# EasyEDA schematic Schematic_Scorpion-Yellow_v12.0.1.json
TITLE: ZS-Scorpion aka "Желток"; REV: 12.2.1; Date: 2025-04-14; Sheet: 1/1; Drawn By: Romych; Company: https://t.me/zs_scorpion
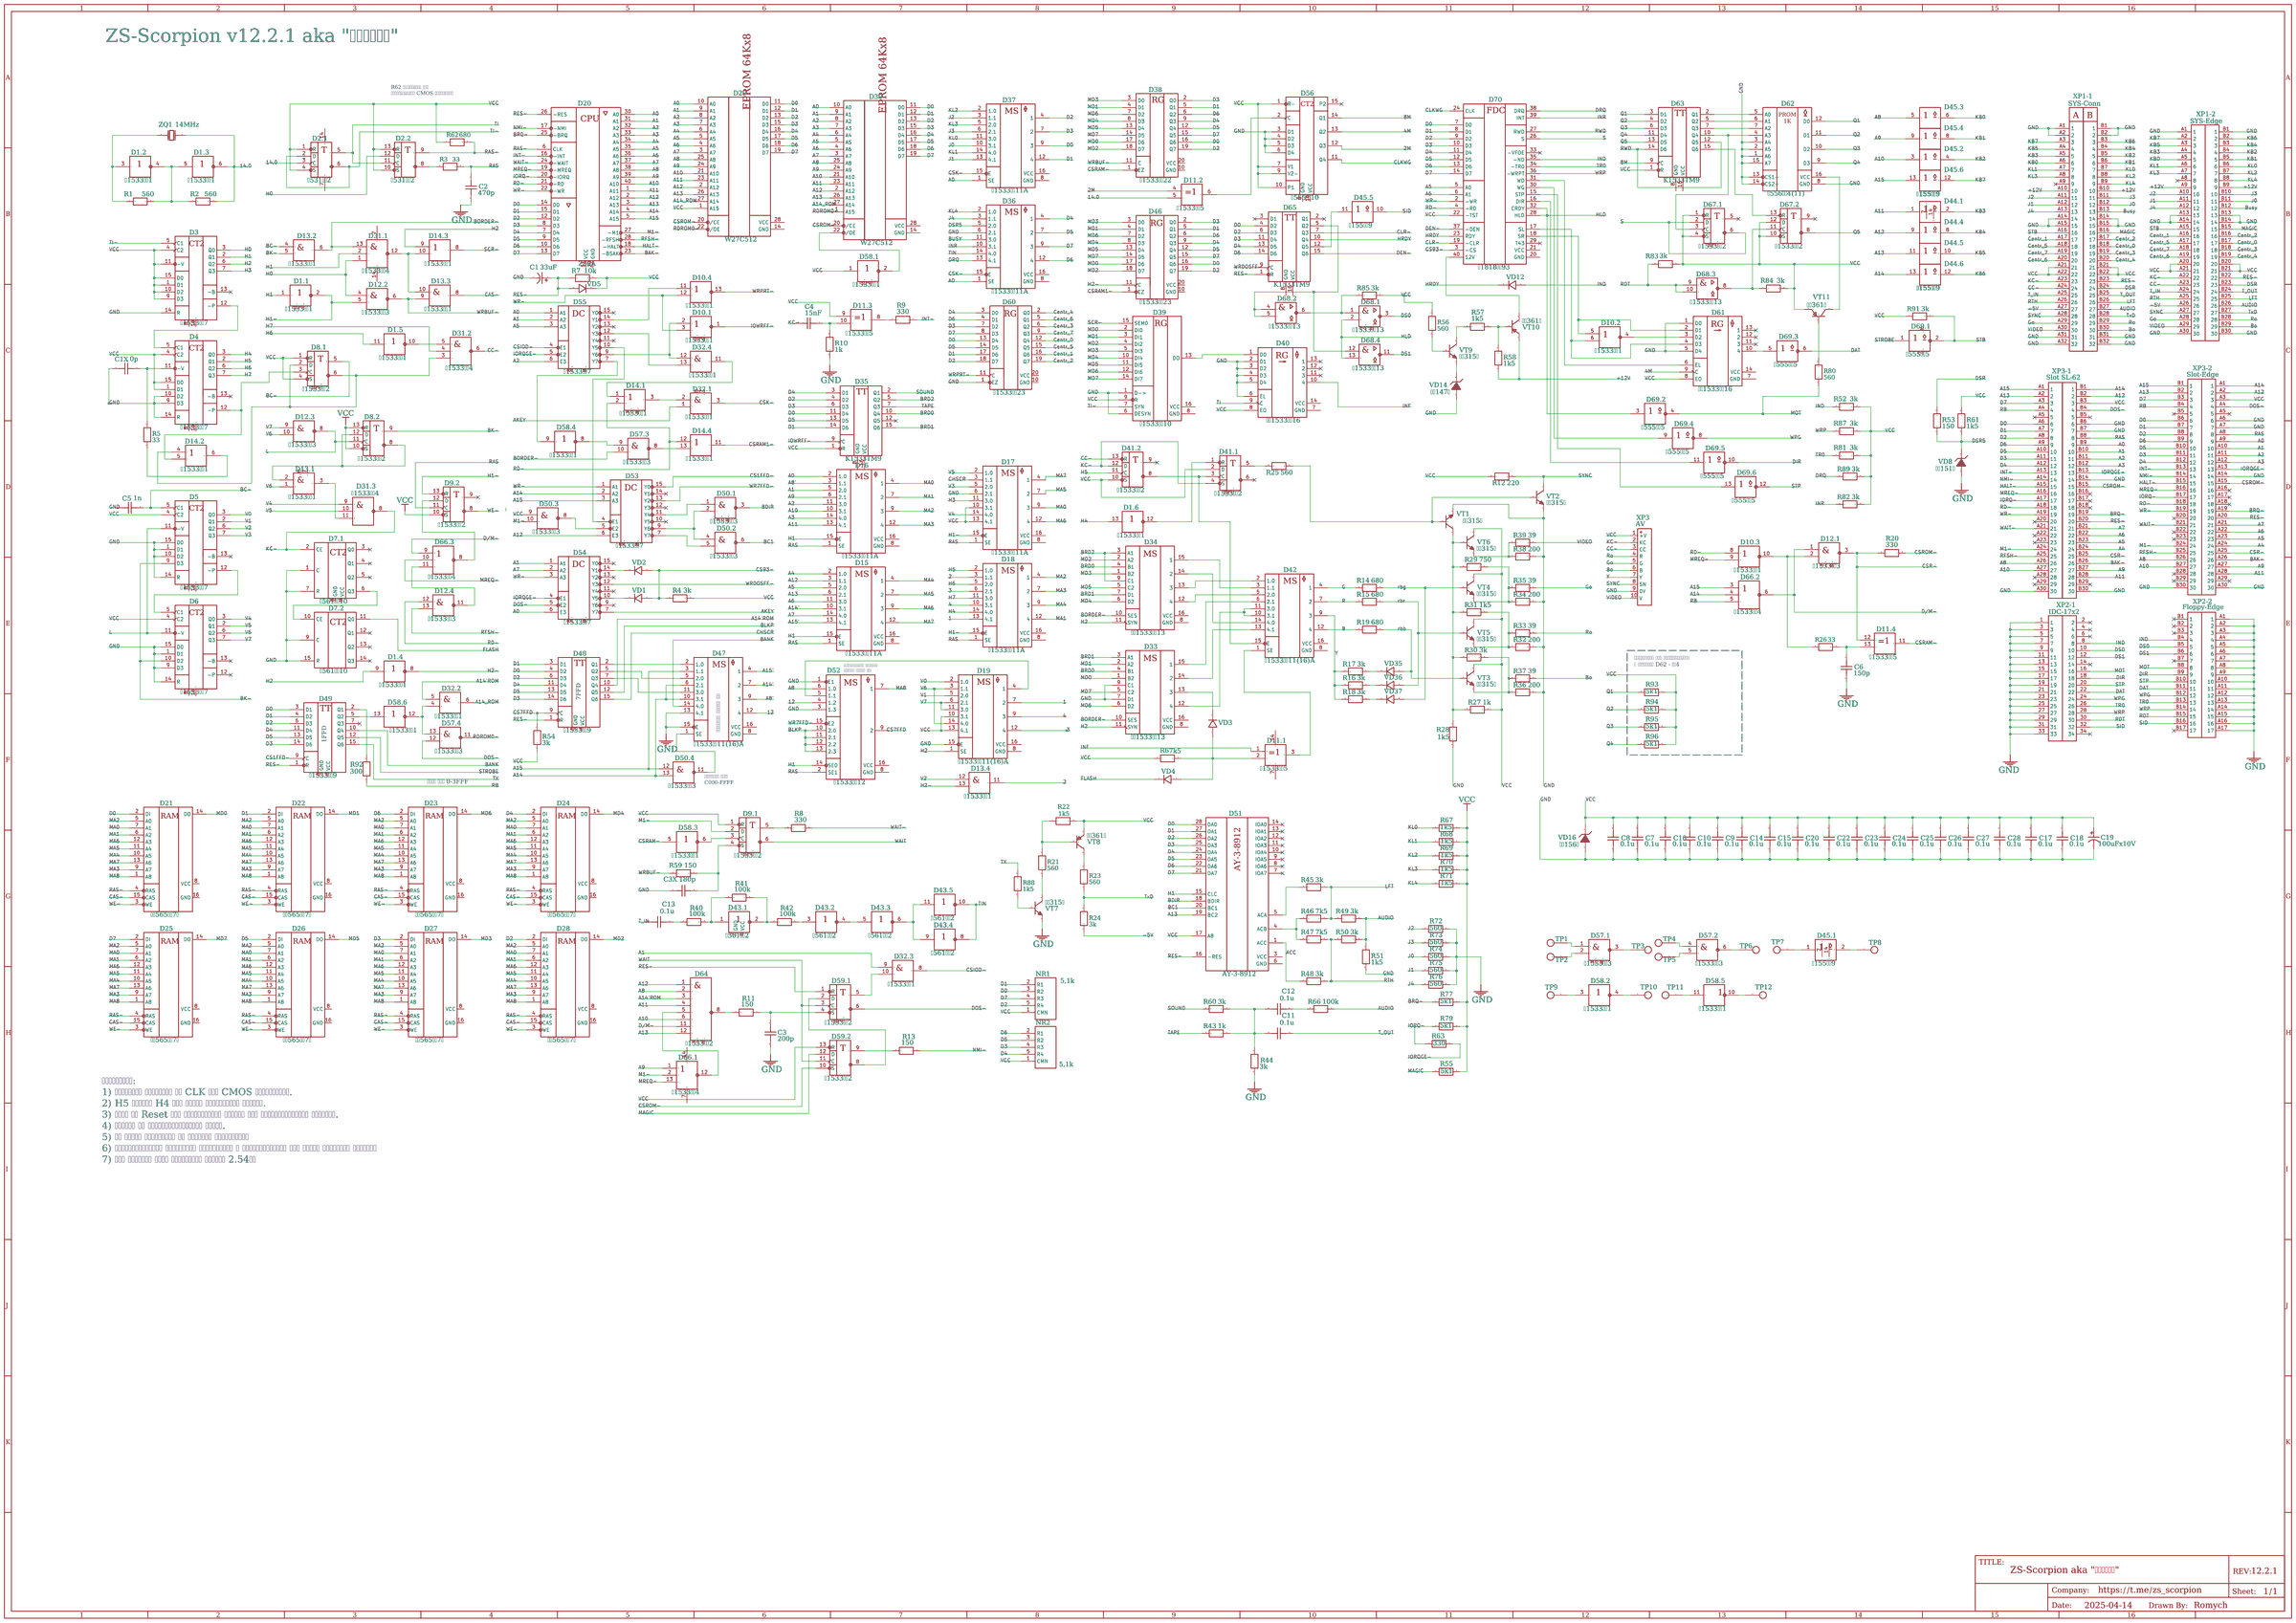
[diagram p0: schematic sheet]

## Parts
C1  33uF  [CAP-TH_BD5.0-P2.50-D1.0-FD]
C1X  0p  [CAP-TH_L3.83]
C2  470p  [CAP-TH_L5.08]
C3  200p  [CAP-TH_L5.08]
C3X  180p  [CAP-TH_L3.83]
C4  15nF  [CAP-TH_L5.08]
C5  1n  [CAP-TH_L3.83]
C6  150p  [CAP-TH_L5.08]
C7  0.1u  [CAP-TH_L5.08]
C8  0.1u  [CAP-TH_L5.08]
C9  0.1u  [CAP-TH_L5.08]
C10  0.1u  [CAP-TH_L5.08]
C11  0.1u  [CAP-TH_L5.08]
C12  0.1u  [CAP-TH_L5.08]
C13  0.1u  [CAP-TH_L5.08]
C14  0.1u  [CAP-TH_L5.08]
C15  0.1u  [CAP-TH_L5.08]
C16  0.1u  [CAP-TH_L5.08]
C17  0.1u  [CAP-TH_L5.08]
C18  0.1u  [CAP-TH_L5.08]
C19  100uFx10V  [CAP-TH_BD6.3-P2.50-D1.0-FD]
C20  0.1u  [CAP-TH_L5.08]
C22  0.1u  [CAP-TH_L5.08]
C23  0.1u  [CAP-TH_L5.08]
C24  0.1u  [CAP-TH_L5.08]
C25  0.1u  [CAP-TH_L5.08]
C26  0.1u  [CAP-TH_L5.08]
C27  0.1u  [CAP-TH_L5.08]
C28  0.1u  [CAP-TH_L5.08]
D1  К1533ЛН1  [DIP-14_STD]  (sections 1,2,3,4,5,6)
D2  К531ТМ2  [DIP-14_STD]  (sections 1,2)
D3  К1533ИЕ7  [DIP-16_STD]
D4  К1533ИЕ7  [DIP-16_STD]
D5  К1533ИЕ7  [DIP-16_STD]
D6  К1533ИЕ7  [DIP-16_STD]
D7  К561ИЕ10  [DIP-16_STD]  (sections 1,2)
D8  К1533ТМ2  [DIP-14_STD]  (sections 1,2)
D9  К1533ТМ2  [DIP-14_STD]  (sections 1,2)
D10  К1533ЛЕ1  [DIP-14_STD]  (sections 1,2,3,4)
D11  К1533ЛП5  [DIP-14_STD]  (sections 1,2,3,4)
D12  К1533ЛА3  [DIP-14_STD]  (sections 1,2,3,4)
D13  К1533ЛИ1  [DIP-14_STD]  (sections 1,2,3,4)
D14  К1533ЛЛ1  [DIP-14_STD]  (sections 1,2,3,4)
D15  К1533КП11A  [DIP-16_STD]
D16  К1533КП11A  [DIP-16_STD]
D17  К1533КП11A  [DIP-16_STD]
D18  К1533КП11A  [DIP-16_STD]
D19  К1533КП11(16)A  [DIP-16_STD]
D20  Z80A  [DIP-40_STD]
D21  КР565РУ7Г  [DIP-16_STD]
D22  КР565РУ7Г  [DIP-16_STD]
D23  КР565РУ7Г  [DIP-16_STD]
D24  КР565РУ7Г  [DIP-16_STD]
D25  КР565РУ7Г  [DIP-16_STD]
D26  КР565РУ7Г  [DIP-16_STD]
D27  КР565РУ7Г  [DIP-16_STD]
D28  КР565РУ7Г  [DIP-16_STD]
D29  W27C512  [DIP-28_L35.6-W17.8-P2.54-LS15.2-BL]
D30  W27C512  [DIP-28_L35.6-W17.8-P2.54-LS15.2-BL]
D31  К1533ЛА4  [DIP-14_STD]  (sections 1,2,3)
D32  К1533ЛИ1  [DIP-14_STD]  (sections 1,2,3,4)
D33  КР1533КП13  [DIP-16_STD]
D34  КР1533КП13  [DIP-16_STD]
D35  K1533TM9  [DIP-16_STD]
D36  К1533КП11A  [DIP-16_STD]
D37  К1533КП11A  [DIP-16_STD]
D38  К1533ИР22  [DIP-20_STD]
D39  К1533ИР10  [DIP-16_STD]
D40  КР1533ИР16  [DIP-14_STD]
D41  К1533ТМ2  [DIP-14_STD]  (sections 1,2)
D42  К1533КП11(16)A  [DIP-16_STD]
D43  К561ЛН2  [DIP-14_STD]  (sections 1,2,3,4,5)
D44  К155ЛП9  [DIP-14_STD]  (sections 1,4,5,6)
D45  К155ЛП9  [DIP-14_STD]  (sections 1,2,3,4,5,6)
D46  К1533ИР23  [DIP-20_STD]
D47  К1533КП11(16)A  [DIP-16_STD]
D48  К1533ТМ9  [DIP-16_STD]
D49  К1533ТМ9  [DIP-16_STD]
D50  К1533ЛА3  [DIP-14_STD]  (sections 1,2,3,4)
D51  AY-3-8912  [DIP-28_STD]
D52  К1533КП12  [DIP-16_STD]
D53  К1533ИД7  [DIP-16_STD]
D54  К1533ИД7  [DIP-16_STD]
D55  К1533ИД7  [DIP-16_STD]
D56  К555ИЕ10  [DIP-16_STD]
D57  К1533ЛА3  [DIP-14_STD]  (sections 1,2,3,4)
D58  К1533ЛН1  [DIP-14_STD]  (sections 1,2,3,4,5,6)
D59  К1533ТМ2  [DIP-14_STD]  (sections 1,2)
D60  К1533ИР23  [DIP-20_STD]
D61  КР1533ИР16  [DIP-14_STD]
D62  К556РТ4(11)  [DIP-16_STD]
D63  K1533TM9  [DIP-16_STD]
D64  К1533ЛА2  [DIP-14_STD]
D65  K1533TM9  [DIP-16_STD]
D66  К1533ЛЕ4  [DIP-14_STD]  (sections 1,2,3)
D67  К1533ТМ2  [DIP-14_STD]  (sections 1,2)
D68  К1533ЛА13  [DIP-14_STD]  (sections 1,2,3,4)
D69  К555ЛН5  [DIP-14_STD]  (sections 1,2,3,4,5,6)
D70  К1818ВГ93  [DIP-40_STD]
NR1  5,1k  [HDR-TH_5P-P2.54]
NR2  5,1k  [HDR-TH_5P-P2.54]
R1  560  [R_0.125_7.62]
R2  560  [R_0.125_7.62]
R3  33  [R_0.125_7.62]
R4  3k  [R_0.125_7.62]
R5  33  [R_0.125_L6.35]
R6  7k5  [R_0.125_7.62]
R7  10k  [R_0.125_7.62]
R8  330  [R_0.125_7.62]
R9  330  [R_0.125_7.62]
R10  1k  [R_0.125_7.62]
R11  150  [R_0.125_7.62]
R12  220  [R_0.125_7.62]
R13  150  [R_0.125_7.62]
R14  680  [R_0.125_7.62]
R15  680  [R_0.125_7.62]
R16  3k  [R_0.125_7.62]
R17  3k  [R_0.125_7.62]
R18  3k  [R_0.125_7.62]
R19  680  [R_0.125_7.62]
R20  330  [R_0.125_7.62]
R21  560  [R_0.125_7.62]
R22  1k5  [R_0.125_7.62]
R23  560  [R_0.125_7.62]
R24  3k  [R_0.125_7.62]
R25  560  [R_0.125_7.62]
R26  33  [R_0.125_7.62]
R27  1k  [R_0.125_7.62]
R28  1k5  [R_0.125_7.62]
R29  750  [R_0.125_7.62]
R30  3k  [R_0.125_7.62]
R31  1k5  [R_0.125_7.62]
R32  200  [R_0.125_7.62]
R33  39  [R_0.125_7.62]
R34  200  [R_0.125_7.62]
R35  39  [R_0.125_7.62]
R36  200  [R_0.125_7.62]
R37  39  [R_0.125_7.62]
R38  200  [R_0.125_7.62]
R39  39  [R_0.125_7.62]
R40  100k  [R_0.125_7.62]
R41  100k  [R_0.125_7.62]
R42  100k  [R_0.125_7.62]
R43  1k  [R_0.125_7.62]
R44  3k  [R_0.125_7.62]
R45  3k  [R_0.125_7.62]
R46  7k5  [R_0.125_7.62]
R47  7k5  [R_0.125_7.62]
R48  3k  [R_0.125_7.62]
R49  3k  [R_0.125_7.62]
R50  3k  [R_0.125_7.62]
R51  1k5  [R_0.125_7.62]
R52  3k  [R_0.125_7.62]
R53  150  [R_0.125_7.62]
R54  3k  [R_0.125_7.62]
R55  5k1  [R_0.125_7.62]
R56  560  [R_0.125_7.62]
R57  1k5  [R_0.125_7.62]
R58  1k5  [R_0.125_7.62]
R59  150  [R_0.125_7.62]
R60  3k  [R_0.125_7.62]
R61  1k5  [R_0.125_7.62]
R62  680  [R_0.125_7.62]
R63  330  [R_0.125_7.62]
R66  100k  [R_0.125_7.62]
R67  1k5  [R_0.125_7.62]
R68  1k5  [R_0.125_7.62]
R69  1k5  [R_0.125_7.62]
R70  1k5  [R_0.125_7.62]
R71  1k5  [R_0.125_7.62]
R72  560  [R_0.125_7.62]
R73  560  [R_0.125_7.62]
R74  560  [R_0.125_7.62]
R75  560  [R_0.125_7.62]
R76  560  [R_0.125_7.62]
R77  5k1  [R_0.125_7.62]
R79  5k1  [R_0.125_7.62]
R80  560  [R_0.125_7.62]
R81  3k  [R_0.125_7.62]
R82  3k  [R_0.125_7.62]
R83  3k  [R_0.125_7.62]
R84  3k  [R_0.125_7.62]
R85  3k  [R_0.125_7.62]
R87  3k  [R_0.125_7.62]
R88  1k5  [R_0.125_7.62]
R89  3k  [R_0.125_7.62]
R91  3k  [R_0.125_7.62]
R92  300  [R_0.125_7.62]
R93  5k1  [R_0.125_7.62]
R94  5k1  [R_0.125_7.62]
R95  5k1  [R_0.125_7.62]
R96  5k1  [R_0.125_7.62]
TP1  SMD-TEST-1-RND  [SMD-TEST-1-SMALL]
TP2  SMD-TEST-1-RND  [SMD-TEST-1-SMALL]
TP3  SMD-TEST-1-RND  [SMD-TEST-1-SMALL]
TP4  SMD-TEST-1-RND  [SMD-TEST-1-SMALL]
TP5  SMD-TEST-1-RND  [SMD-TEST-1-SMALL]
TP6  SMD-TEST-1-RND  [SMD-TEST-1-SMALL]
TP7  SMD-TEST-1-RND  [SMD-TEST-1-SMALL]
TP8  SMD-TEST-1-RND  [SMD-TEST-1-SMALL]
TP9  SMD-TEST-1-RND  [SMD-TEST-1-SMALL]
TP10  SMD-TEST-1-RND  [SMD-TEST-1-SMALL]
TP11  SMD-TEST-1-RND  [SMD-TEST-1-SMALL]
TP12  SMD-TEST-1-RND  [SMD-TEST-1-SMALL]
VD1  1N4148  [D_TH_7.62]
VD2  1N4148  [D_TH_7.62]
VD3  1N4148  [D_TH_7.62]
VD4  1N4148  [D_TH_7.62]
VD5  1N4148  [D_TH_7.62]
VD8  КС151А  [D_TH_7.62]
VD12  1N4148  [D_TH_7.62]
VD14  КС147А  [D_TH_7.62]
VD16  КС156А  [D_TH_7.62]
VD35  1N4148  [D_TH_7.62]
VD36  1N4148  [D_TH_7.62]
VD37  1N4148  [D_TH_7.62]
VT1  КТ315Б  [KT315_STD]
VT2  КТ315Б  [KT315_STD]
VT3  КТ315Б  [KT315_STD]
VT4  КТ315Б  [KT315_STD]
VT5  КТ315Б  [KT315_STD]
VT6  КТ315Б  [KT315_STD]
VT7  КТ315Б  [KT315_STD]
VT8  КТ361Б  [KT315_STD]
VT9  КТ315Б  [KT315_STD]
VT10  КТ361Б  [KT315_STD]
VT11  КТ361Б  [KT315_STD]
XP1-1  SYS-Conn  [CONN_TH_DIN41612_64P_2X32_ANG_INV]
XP1-2  SYS-Edge  [PCB_EDGE_CONNECTOR_30X2]
XP2-1  IDC-17x2  [IDC-TH-34P-17X2_2.54]
XP2-2  Floppy-Edge  [PCB_EDGE_CONNECTOR_17X2]
XP3  AV  [HDR-TH_10P-P2.54-V-M]
XP3-1  Slot SL-62  [SL62_P2.54_R2]
XP3-2  Slot-Edge  [PCB_EDGE_CONNECTOR_30X2]
ZQ1  14MHz  [OSC-49_STD_H]

## Library data of the parts
C1 C19 = ECLJ0612220M101P00: Supplier: LCSC; Supplier Part: C156809; Manufacturer: Guangdong TOPAZ Elec Tech; Contributor: LCSC
C1X C3X C5 = CK45-R3AD152K-VRY: Supplier: LCSC; Supplier Part: C340608; Manufacturer: TDK; Contributor: LCSC; JLCPCB Part Class: Extended Part
C2-C4 C6-C18 C20 C22-C28 = CK45-R3AD152K-VRY: Supplier: LCSC; Supplier Part: C340608; Manufacturer: TDK; Contributor: LCSC
D1 = К1533ЛН1: Supplier: chipdip; Contributor: Roman Boykov; subpart_no: 8
D2 = К531ТМ2: Supplier: chipdip; Contributor: Roman Boykov; subpart_no: 1
D3-D6 = К1533ИЕ7: Contributor: romychs_4693
D7 = К561ИЕ10: Supplier: chipdip; Contributor: romychs_4693; subpart_no: 1
D8 D41 D59 D67 = К1533ТМ2: Supplier: chipdip; Contributor: romychs_4693; subpart_no: 3
D9 = К1533ТМ2: Supplier: chipdip; Contributor: romychs_4693; subpart_no: 4
D10 = К1533ЛЕ1: Supplier: chipdip; Contributor: Roman Boykov; subpart_no: 1
D11 = К1533ЛП5: Supplier: chipdip; Contributor: Roman Boykov; subpart_no: 1
D12 D50 D57 = К1533ЛА3: Supplier: chipdip; Contributor: Roman Boykov; subpart_no: 1
D13 D32 = К1533ЛИ1: Supplier: chipdip; Contributor: Roman Boykov; subpart_no: 1
D14 = К1533ЛЛ1: Supplier: chipdip; Contributor: Roman Boykov; subpart_no: 1
D15-D19 D36 D37 D42 D47 = К1533КП11A: Supplier: chipdip; Contributor: Roman Boykov
D20 = Z80B: Manufacturer: Zilog; Contributor: romychs_4693
D21-D28 = КР565РУ7Г: Supplier: chipdip; Contributor: Roman Boykov
D29 D30 = W27C512-45: Manufacturer: Winbond; Supplier: chipdip; Contributor: Roman Boykov
D31 = К1533ЛА4: Supplier: chipdip; Contributor: Roman Boykov; subpart_no: 1
D33 D34 = КР1533КП13: Supplier: chipdip; Contributor: romychs_4693
D35 D63 D65 = K1533TM9: Supplier: chipdip; Contributor: Roman Boykov
D38 = К1533ИР22: Supplier: chipdip; link: TTL; Регистр; ИР22; Contributor: Roman Boykov
D39 = К1533ИР10: Supplier: chipdip; link: TTL; Регистр; ИР23; Contributor: Roman Boykov
D40 D61 = КР1533ИР16: Supplier: chipdip; Contributor: romychs_4693
D43 = К561ЛН2: Supplier: chipdip; Contributor: romychs_4693; subpart_no: 1
D44 = К155ЛП9: Supplier: chipdip; Contributor: Roman Boykov; subpart_no: 2
D45 = К155ЛП9: Supplier: chipdip; Contributor: Roman Boykov; subpart_no: 5
D46 D60 = К1533ИР23: Supplier: chipdip; link: TTL; Регистр; ИР23; Contributor: romychs_4693
D48 D49 = К1533ТМ9: Supplier: chipdip; Contributor: Roman Boykov
D51 = AY-3-8912: Supplier: chipdip; Contributor: romychs_4693
D52 = К1533КП12: Supplier: chipdip; Contributor: romychs_4693
D53-D55 = К1533ИД7: Supplier: chipdip; Contributor: romychs_4693; subpart_no: 4
D56 = К555ИЕ10: Contributor: romychs_4693
D58 = К1533ЛН1: Supplier: chipdip; Contributor: Roman Boykov; subpart_no: 7
D62 = К556РТ4: Contributor: romychs_4693
D64 = К1533ЛА2: Supplier: chipdip; Contributor: Roman Boykov
D66 = К1533ЛЕ4: Supplier: chipdip; Contributor: Roman Boykov; subpart_no: 1
D68 = К1533ЛА13: Supplier: chipdip; Contributor: Roman Boykov; subpart_no: 1
D69 = К555ЛН5: Supplier: chipdip; Contributor: Roman Boykov; subpart_no: 7
D70 = К1818ВГ93: link: ВГ93; FDD; Contributor: Roman Boykov
NR1 NR2 = НР-4: Supplier: chipdip; Contributor: Roman Boykov
R1-R4 R6-R63 R66-R77 R79-R85 R87-R89 R91-R96 = RN 1/8W 470R F T/B A1: Supplier: LCSC; Supplier Part: C433478; Manufacturer: TyoHM; Contributor: LCSC
R5 = RN 1/8W 470R F T/B A1: Supplier: LCSC; Supplier Part: C433478; Manufacturer: Tyohm(幸亚电阻); Contributor: LCSC; Resistance (Ohms): 470; JLCPCB Part Class: Extended Part
TP1-TP12 = SMD-TEST-1-RND: Contributor: Roman Boykov
VD1-VD5 VD12 VD35-VD37 = 1N4148: Contributor: EasyEDA
VD8 VD14 VD16 = 1N4742A: Supplier: LCSC; Manufacturer: Tak Cheong; Supplier Part: C113210; JLCPCB Part Class: Extended Part
VT1-VT7 VT9 = 2SC1815-TA: Supplier: LCSC; Manufacturer: CJ; image: //image.lceda.cn/szlcsc/C41114.jpg; Supplier Part: C41114; JLCPCB Part Class: Extended Part
VT8 VT10 VT11 = 2SA1015-TA: Supplier: LCSC; Supplier Part: C160132; Manufacturer: Changjiang Electronics Tech (CJ); Contributor: LCSC
XP1-1 = SCORPION_SYS_2X32: Contributor: Roman Boykov
XP1-2 = SCORP-EDGE-SYS: Contributor: romychs_4693
XP2-1 = IDC-TH-34P-17x2_2.54: Manufacturer: Connfy; Contributor: romychs_4693
XP2-2 = SCORP-EDGE-FLOPPY: Contributor: romychs_4693
XP3 = X6511WV-10H-C30D60: Supplier: LCSC; Supplier Part: C706882; Manufacturer: XKB Connectivity; Contributor: LCSC; LCSC Assembly: Yes; SMT Type: Extend
XP3-1 = PinHeader_2x30: Contributor: Roman Boykov
XP3-2 = SCORP-EDGE-SLOT: Contributor: romychs_4693
ZQ1 = X49UD12MSD2SC: Supplier: LCSC; Manufacturer: YXC; Supplier Part: C2188

## Nets
+12V: R58.1 VT10.1(E) XP1-1.A10(10) XP1-1.B10(10) XP1-2.A9(9) XP1-2.B9(9)
-5V: R24.1 XP1-1.A27(27) XP1-2.A26(26)
GND: C1.2 C1X.2 C2.2 C3.2 C3X.1 C5.2 C6.2 C7.1 C8.1 C9.1 C10.1 C14.1 C15.1 C16.1 C17.1 C18.1 C19.2 C20.1 C22.1 C23.1 C24.1 C25.1 C26.1 C27.1 C28.1 D3.14(R) D4.9(D3) D4.10(D2) D4.14(R) D5.1(D1) D5.10(D2) D5.14(R) D5.15(D0) D6.1(D1) D6.9(D3) D6.14(R) D6.15(D0) D7.1(C) D7.7(R) D7.9(C) D7.15(R) D17.6(2.1) D19.15(E) D33.7(D1) D33.9(C1) D36.6(2.1) D39.1(D->) D39.6(DESYN) D40.2(D1) D40.3(D2) D40.4(D3) D40.5(D4) D40.6(EL) D47.13(4.1) D47.15(E) D52.1(E1) D52.3(1.3) D56.3(D1) D56.4(D2) D56.5(D3) D56.6(D4) D60.1(EZ) D61.1(D0) D61.5(D4) D62.1(A6) D62.2(A5) D62.3(A4) D62.8(GND) D62.13(CS1-) D62.14(CS2-) D62.15(A7) R10.1 R28.2 R32.1 R34.1 R36.1 R38.1 R44.2 R51.2 R72.1 R73.1 R74.1 R75.1 R76.1 VD8.1(A) VD14.1(A) VD16.1(A) VT1.1(E) VT2.1(E) VT7.1(E) XP1-1.A1(1) XP1-1.A2(2) XP1-1.A14(14) XP1-1.A15(15) XP1-1.A31(31) XP1-1.A32(32) XP1-1.B1(1) XP1-1.B2(2) XP1-1.B14(14) XP1-1.B15(15) XP1-1.B31(31) XP1-1.B32(32) XP1-2.A1(1) XP1-2.A13(13) XP1-2.A14(14) XP1-2.A30(30) XP1-2.B1(1) XP1-2.B13(13) XP1-2.B14(14) XP1-2.B30(30) XP2-1.1 XP2-1.3 XP2-1.5 XP2-1.7 XP2-1.9 XP2-1.11 XP2-1.13 XP2-1.15 XP2-1.17 XP2-1.19 XP2-1.21 XP2-1.23 XP2-1.25 XP2-1.27 XP2-1.29 XP2-1.31 XP2-1.33 XP2-2.A1(1) XP2-2.A2(2) XP2-2.A3(3) XP2-2.A4(4) XP2-2.A5(5) XP2-2.A6(6) XP2-2.A7(7) XP2-2.A8(8) XP2-2.A9(9) XP2-2.A10(10) XP2-2.A11(11) XP2-2.A12(12) XP2-2.A13(13) XP2-2.A14(14) XP2-2.A15(15) XP2-2.A16(16) XP2-2.A17(17) XP3.9(0V) XP3-1.A30(30) XP3-1.B6(6) XP3-1.B7(7) XP3-1.B14(14) XP3-1.B30(30) XP3-2.A6(6) XP3-2.A7(7) XP3-2.A14(14) XP3-2.A30(30) XP3-2.B30(30)
V0: D5.3(Q0) D19.2(1.0)
V1: D5.2(Q1) D19.5(2.0)
V2: D5.6(Q2) D13.12(1)
V3: D5.7(Q3) D17.5(2.0)
V4: D6.3(Q0) D17.14(4.0) D31.9(I1)
V5: D6.2(Q1) D17.2(1.0) D31.10(I2)
V6: D6.6(Q2) D12.10(2) D13.1 D19.3(1.1) D19.14(4.0)
V7: D6.7(Q3) D12.9(1) D19.6(2.1) D19.11(3.0)
VCC: C7.2 C8.2 C9.2 C10.2 C14.2 C15.2 C16.2 C17.2 C18.2 C19.1 C20.2 C22.2 C23.2 C24.2 C25.2 C26.2 C27.2 C28.2 D2.1(R) D2.4(S) D2.10(S) D2.13(R) D3.1(D1) D3.4(C2) D3.9(D3) D3.10(D2) D3.11(-V) D3.15(D0) D4.1(D1) D4.4(C2) D4.15(D0) D5.4(C2) D6.4(C2) D8.1(R) D8.4(S) D8.10(S) D8.13(R) D9.1(R) D9.10(S) D11.9(1) D17.10(3.1) D17.13(4.1) D19.10(3.1) D19.13(4.1) D29.1(A15) D35.1(R) D39.9(R) D40.8(EO) D41.2(D) D41.10(S) D50.9(1) D51.17(A8) D56.1(R-) D56.7(V1) D56.9(V2-) D56.10(P1) D58.1 D59.13(R) D61.8(EO) D63.1(R) D67.1(R) D67.4(S) D67.10(S) D67.12(D) D70.22(-TST) NR1.1(CMN) NR2.1(CMN) R4.1 R6.1 R7.2 R12.2 R22.2 R27.1 R52.2 R54.1 R55.1 R56.2 R61.1 R62.1 R67.1 R68.1 R69.1 R70.1 R71.1 R77.1 R79.1 R81.2 R82.2 R83.2 R84.2 R85.2 R87.2 R89.2 R91.1 R93.1 R94.1 R95.1 R96.1 VD5.2(K) VD16.2(K) VT3.2(C) VT4.2(C) VT5.2(C) VT6.2(C) VT8.1(E) VT11.1(E) XP1-1.A21(21) XP1-1.A22(22) XP1-1.B21(21) XP1-1.B22(22) XP1-2.A20(20) XP1-2.A21(21) XP1-2.B20(20) XP1-2.B21(21) XP3.1(+V) XP3-1.B3(3) XP3-2.A3(3)
1: D18.13(4.1) D19.7(2)
2: D13.11(3) D18.3(1.1)
2M: D11.4(1) D56.12(Q3)
3: D18.6(2.1) D19.12(4)
4: D18.10(3.1) D19.9(3)
4M: D56.13(Q2) D61.9(C)
8M: D56.14(Q1) D63.9(C)
12: D47.12(4) D52.4(1.2)
14.0: D1.6(2) D2.3(С) D11.5(2) R2.2 ZQ1.1(OSC1)
A0: D16.2(1.0) D20.30(A0) D29.10(A0) D30.10(A0) D36.1(SE) D37.1(SE) D54.6(E3) D55.1(A1) XP3-1.B9(9) XP3-2.A9(9)
A1: D16.5(2.0) D20.31(A1) D29.9(A1) D30.9(A1) D32.9(1) D54.1(A1) D55.2(A2) XP3-1.B10(10) XP3-2.A10(10)
A2: D16.11(3.0) D20.32(A2) D29.8(A2) D30.8(A2) D55.6(E3) XP3-1.B11(11) XP3-2.A11(11)
A3: D16.14(4.0) D20.33(A3) D29.7(A3) D30.7(A3) XP3-1.B12(12) XP3-2.A12(12)
A4: D15.2(1.0) D20.34(A4) D29.6(A4) D30.6(A4) XP3-1.B24(24) XP3-2.A24(24)
A5: D15.5(2.0) D20.35(A5) D29.5(A5) D30.5(A5) D55.3(A3) D70.5(A0) XP3-1.B23(23) XP3-2.A23(23)
A6: D15.11(3.0) D20.36(A6) D29.4(A6) D30.4(A6) D70.6(A1) XP3-1.B22(22) XP3-2.A22(22)
A7: D15.14(4.0) D20.37(A7) D29.3(A7) D30.3(A7) D54.2(A2) XP3-1.B21(21) XP3-2.A21(21)
A8: D20.38(A8) D29.25(A8) D30.25(A8) D45.5(1) D52.6(1.0) D64.2 XP3-1.A26(26) XP3-2.B26(26)
A8': D16.3(1.1) D47.9(3)
A9: D16.6(2.1) D20.39(A9) D29.24(A9) D30.24(A9) D45.9(1) D66.1(I1) XP3-1.B27(27) XP3-2.A27(27)
A10: D16.10(3.1) D20.40(A10) D29.21(A10) D30.21(A10) D45.3(1) D64.6 XP3-1.A27(27) XP3-2.B27(27)
A11: D16.13(4.1) D20.1(A11) D29.23(A11) D30.23(A11) D44.1 D64.4 XP3-1.B28(28) XP3-2.A28(28)
A12: D15.3(1.1) D20.2(A12) D29.2(A12) D30.2(A12) D44.9(1) D53.6(E3) D64.1 XP3-1.B2(2) XP3-2.A2(2)
A13: D15.6(2.1) D20.3(A13) D29.26(A13) D30.26(A13) D44.11(1) D51.19(BC2) D64.12(8) XP3-1.A2(2) XP3-2.B2(2)
A14: D20.4(A14) D44.13(1) D47.6(2.1) D47.10(3.1) D50.13(2) D53.2(A2) D66.4(I2) XP3-1.B1(1) XP3-2.A1(1)
A14': D15.10(3.1) D47.7(2)
A14'ROM: D32.5(2) D48.10(Q4) D64.3
A14_ROM: D29.27(A14) D30.27(A14) D32.6(3)
A15: D20.5(A15) D45.13(1) D47.3(1.1) D50.12(1) D53.3(A3) D66.3(I1) XP3-1.A1(1) XP3-2.B1(1)
A15': D15.13(4.1) D47.4(1)
ACC: D51.1(ACC) R48.2
AKEY: D32.1 D54.7(Y7)
AUDIO: R49.1 R50.1 R51.1 R66.1 XP1-1.B27(27) XP1-2.B26(26)
B: D42.12(4) R19.2
BAK-: D20.23(-BSAK) XP3-1.B26(26) XP3-2.A26(26)
BANK: D47.14(4.0) D49.10(Q4)
BC1: D50.6(3) D51.20(BC1)
BC-: C5.1 D5.5(C1) D8.5(Q) D13.4(1)
BDIR: D50.3 D51.18(BDIR)
BK-: D5.9(D3) D6.10(D2) D8.9(Q) D13.5(2)
BLKP: D48.12(Q5) D52.10(2.0) D52.11(2.1) D52.12(2.2) D52.13(2.3)
Bo: R37.1 XP1-1.B30(30) XP1-2.B29(29) XP3.6(B)
BORDER-: D13.6(3) D31.13(I3) D33.10(SES) D34.10(SES) D57.10(2)
BRD0: D33.4(B1) D34.4(B1) D35.10(Q4)
BRD1: D33.3(A1) D34.7(D1) D35.15(Q6)
BRD2: D34.3(A1) D34.9(C1) D35.5(Q2)
BRQ-: D20.25(-BRQ) R77.2 XP3-1.B19(19) XP3-2.A19(19)
Busy: XP1-1.B13(13) XP1-2.B12(12)
BUSY: D36.11(3.0)
CAS-: D13.8(3) D21.15(CAS) D22.15(CAS) D23.15(CAS) D24.15(CAS) D25.15(CAS) D26.15(CAS) D27.15(CAS) D28.15(CAS)
CC-: D31.6(O) D41.13(R) XP1-1.A24(24) XP1-2.A23(23) XP3.3(CC)
Centr_0: D60.12(Q4) XP1-1.B18(18) XP1-2.B17(17)
Centr_1: D60.16(Q6) XP1-1.A17(17) XP1-2.A16(16)
Centr_2: D60.19(Q7) XP1-1.B17(17) XP1-2.B16(16)
Centr_3: D60.6(Q2) XP1-1.B19(19) XP1-2.B18(18)
Centr_4: D60.2(Q0) XP1-1.B20(20) XP1-2.B19(19)
Centr_5: D60.15(Q5) XP1-1.A18(18) XP1-2.A17(17)
Centr_6: D60.5(Q1) XP1-1.A20(20) XP1-2.A19(19)
Centr_7: D60.9(Q3) XP1-1.A19(19) XP1-2.A18(18)
CHSCR: D17.3(1.1) D48.15(Q6)
CLKWG: D56.11(Q4) D70.24(CLK)
CLR-: D65.7(Q3) D70.19(-CLR)
CS1FFD-: D49.9(C) D53.15(Y0)
CS7FFD: D48.9(C) D52.9(2) R54.2
CS93-: D70.3(-CS) R4.2 VD1.1(A) VD2.1(A)
CSIOD-: D32.8(3) D55.4(E1)
CSK-: D32.3 D36.15(E) D37.15(E)
CSR-: D11.12(1) D12.3 R20.1 XP3-1.B25(25) XP3-2.A25(25)
CSRAM1-: D14.11(3) D46.1(EZ)
CSRAM-: D11.11(3) D38.1(EZ) D58.5(1)
CSROM-: D29.20(/CE) D30.20(/CE) D59.10(S) R20.2 XP3-1.B15(15) XP3-2.A15(15)
D0: D20.14(D0) D21.2(DI) D29.11(D0) D30.11(D0) D35.11(D4) D37.9(3) D38.16(Q6) D46.16(Q6) D48.4(D2) D49.3(D1) D51.28(DA0) D60.13(D4) D65.4(D2) D70.7(D0) NR1.3(R2) XP3-1.A6(6) XP3-2.B6(6)
D1: D20.15(D1) D22.2(DI) D29.12(D1) D30.12(D1) D35.14(D6) D37.12(4) D38.5(Q1) D46.5(Q1) D48.3(D1) D49.4(D2) D51.27(DA1) D60.17(D6) D70.8(D1) NR1.2(R1) XP3-1.A7(7) XP3-2.B7(7)
D2: D20.12(D2) D28.2(DI) D29.13(D2) D30.13(D2) D35.4(D2) D37.4(1) D38.19(Q7) D46.19(Q7) D48.6(D3) D49.6(D3) D51.26(DA2) D60.18(D7) D65.6(D3) D70.9(D2) NR1.5(R4) XP3-1.A8(8) XP3-2.B8(8)
D3: D20.8(D3) D27.2(DI) D29.15(D3) D30.15(D3) D35.6(D3) D37.7(2) D38.2(Q0) D46.2(Q0) D48.14(D6) D49.14(D6) D51.25(DA3) D60.7(D2) D65.11(D4) D70.10(D3) NR2.4(R3) XP3-1.A11(11) XP3-2.B11(11)
D4: D20.7(D4) D24.2(DI) D29.16(D4) D30.16(D4) D35.3(D1) D36.4(1) D38.9(Q3) D46.9(Q3) D48.11(D4) D49.11(D4) D51.24(DA4) D60.3(D0) D65.13(D5) D70.11(D4) NR2.5(R4) XP3-1.A12(12) XP3-2.B12(12)
D5: D20.9(D5) D26.2(DI) D29.17(D5) D30.17(D5) D35.13(D5) D36.7(2) D38.12(Q4) D46.12(Q4) D48.13(D5) D49.13(D5) D51.23(DA5) D60.14(D5) D70.12(D5) NR2.3(R2) XP3-1.A10(10) XP3-2.B10(10)
D6: D20.10(D6) D23.2(DI) D29.18(D6) D30.18(D6) D36.12(4) D38.6(Q2) D46.6(Q2) D51.22(DA6) D60.4(D1) D65.14(D6) D70.13(D6) NR2.2(R1) XP3-1.A9(9) XP3-2.B9(9)
D7: D20.13(D7) D25.2(DI) D29.19(D7) D30.19(D7) D36.9(3) D38.15(Q5) D46.15(Q5) D51.21(DA7) D60.8(D3) D70.14(D7) NR1.4(R3) XP3-1.A3(3) XP3-2.B3(3)
D/M-: D12.1 D64.11(7) D66.6(O) D66.9(I1)
DAT: D69.6(2) XP2-1.22 XP2-2.B11(11)
DEN-: D65.15(Q6) D70.37(-DEN)
DIR: D69.10(2) XP2-1.18 XP2-2.B9(9)
DOS-: D54.5(E2) D57.12(1) D59.6(&#126;Q) XP3-1.B4(4) XP3-2.A4(4)
DRQ: D36.13(4.1) D70.38(DRQ) R89.1
DS0: D68.3 XP2-1.10 XP2-2.B5(5)
DS1: D68.11(3) XP2-1.12 XP2-2.B6(6)
DSR: R53.1 XP1-1.B24(24) XP1-2.B23(23)
DSR5: D36.5(2.0) R53.2 R61.2 VD8.2(K)
FLASH: D7.11(Q0) VD4.2(K)
G: D42.4(1) R14.2
Go: R35.1 XP1-1.A29(29) XP1-2.A28(28) XP3.5(G)
H0: D2.12(D) D3.3(Q0) D12.4(1) D31.1(I1)
H1: D1.1 D3.2(Q1) D15.15(E) D16.15(E) D31.2(I2) D51.15(CLC) D52.14(SE0)
H1-: D1.2 D9.13(R) D12.5(2) D17.15(E) D18.15(E)
H2: D1.9(1) D3.6(Q2) D14.9(1) D19.1(SE) D33.11(SYN) D34.11(SYN)
H2-: D1.8(2) D13.13(2) D46.11(C)
H3: D3.7(Q3) D17.11(3.0)
H4: D1.13(1) D4.3(Q0) D18.14(4.0)
H5: D4.2(Q1) D18.2(1.0) D41.11(C)
H6: D1.11(1) D4.6(Q2) D18.5(2.0)
H7: D4.7(Q3) D18.11(3.0) D31.4(I2)
HALT-: D20.18(-HALT) XP3-1.A15(15) XP3-2.B15(15)
HLD: D68.2 D68.13(2) D69.3(1) D70.28(HLD) D70.32(CRDY)
HRDY: D65.10(Q4) D70.23(RDY) VD12.2(K)
IND: D70.35(-ND) R52.1 VD12.1(A) XP2-1.8 XP2-2.B4(4)
INF: D11.1 D40.10(4)
INR: D36.10(3.1) D70.39(INT) R82.1
INT-: D20.16(-INT) R9.2 XP3-1.A13(13) XP3-2.B13(13)
IORQ-: D20.20(-IORQ) R63.2 R79.2 XP3-1.A17(17) XP3-2.B17(17)
IORQGE-: D54.4(E1) D55.5(E2) R63.1 XP3-1.B13(13) XP3-2.A13(13)
IOWRFF-: D10.1(3) D35.9(C)
J0: D37.10(3.1) R74.2 XP1-1.B12(12) XP1-2.B11(11)
J1: D37.13(4.1) R75.2 XP1-1.A12(12) XP1-2.A11(11)
J2: D37.3(1.1) R72.2 XP1-1.A11(11) XP1-2.A10(10)
J3: D37.6(2.1) R73.2 XP1-1.B11(11) XP1-2.B10(10)
J4: D36.3(1.1) R76.2 XP1-1.A13(13) XP1-2.A12(12)
KB0: D45.6(2) XP1-1.A6(6) XP1-2.A5(5)
KB1: D45.8(2) XP1-1.B6(6) XP1-2.B5(5)
KB2: D45.4(2) XP1-1.B5(5) XP1-2.B4(4)
KB3: D44.2 XP1-1.A5(5) XP1-2.A4(4)
KB4: D44.8(2) XP1-1.B4(4) XP1-2.B3(3)
KB5: D44.10(2) XP1-1.A4(4) XP1-2.A3(3)
KB6: D44.12(2) XP1-1.B3(3) XP1-2.B2(2)
KB7: D45.12(2) XP1-1.A3(3) XP1-2.A2(2)
KC-: C4.1 D7.2(CE) D31.8(O) D41.4(S) D41.12(D) XP1-1.A23(23) XP1-2.A22(22) XP3.2(KC)
KL0: D37.11(3.0) R67.2 XP1-1.B7(7) XP1-2.B6(6)
KL1: D37.14(4.0) R68.2 XP1-1.A7(7) XP1-2.A6(6)
KL2: D37.2(1.0) R69.2 XP1-1.B8(8) XP1-2.B7(7)
KL3: D37.5(2.0) R70.2 XP1-1.A8(8) XP1-2.A7(7)
KL4: D36.2(1.0) R71.2 XP1-1.B9(9) XP1-2.B8(8)
L: D5.11(-V) D6.11(-V) D8.11(C) D12.8(3)
LFT: R45.1 R46.1 R49.2 XP1-1.B26(26) XP1-2.B25(25)
M1-: D9.2(D) D20.27(-M1) D50.10(2) D66.2(I2) XP3-1.A24(24) XP3-2.B24(24)
MA0: D16.4(1) D17.9(3) D21.7(A1) D22.7(A1) D23.7(A1) D24.7(A1) D25.7(A1) D26.7(A1) D27.7(A1) D28.7(A1)
MA1: D16.7(2) D18.12(4) D21.6(A2) D22.6(A2) D23.6(A2) D24.6(A2) D25.6(A2) D26.6(A2) D27.6(A2) D28.6(A2)
MA2: D16.9(3) D18.4(1) D21.5(A0) D22.5(A0) D23.5(A0) D24.5(A0) D25.5(A0) D26.5(A0) D27.5(A0) D28.5(A0)
MA3: D16.12(4) D18.7(2) D21.9(A7) D22.9(A7) D23.9(A7) D24.9(A7) D25.9(A7) D26.9(A7) D27.9(A7) D28.9(A7)
MA4: D15.4(1) D18.9(3) D21.10(A5) D22.10(A5) D23.10(A5) D24.10(A5) D25.10(A5) D26.10(A5) D27.10(A5) D28.10(A5)
MA5: D15.7(2) D17.7(2) D21.11(A4) D22.11(A4) D23.11(A4) D24.11(A4) D25.11(A4) D26.11(A4) D27.11(A4) D28.11(A4)
MA6: D15.9(3) D17.12(4) D21.12(A3) D22.12(A3) D23.12(A3) D24.12(A3) D25.12(A3) D26.12(A3) D27.12(A3) D28.12(A3)
MA7: D15.12(4) D17.4(1) D21.13(A6) D22.13(A6) D23.13(A6) D24.13(A6) D25.13(A6) D26.13(A6) D27.13(A6) D28.13(A6)
MA8: D21.1(A8) D22.1(A8) D23.1(A8) D24.1(A8) D25.1(A8) D26.1(A8) D27.1(A8) D28.1(A8) D52.7(1)
MAGIC: D59.12(D) R55.2 XP1-1.B16(16) XP1-2.B15(15)
MD0: D21.14(DO) D33.1(B2) D38.17(D6) D39.2(DI0) D46.17(D6)
MD1: D22.14(DO) D33.2(A2) D38.4(D1) D39.3(DI1) D46.4(D1)
MD2: D28.14(DO) D34.2(A2) D38.18(D7) D39.4(DI2) D46.18(D7)
MD3: D27.14(DO) D34.1(B2) D38.3(D0) D39.5(DI3) D46.3(D0)
MD4: D24.14(DO) D34.6(D2) D38.8(D3) D39.10(DI4) D46.8(D3)
MD5: D26.14(DO) D34.5(C2) D38.13(D4) D39.11(DI5) D46.13(D4)
MD6: D23.14(DO) D33.6(D2) D38.7(D2) D39.12(DI6) D46.7(D2)
MD7: D25.14(DO) D33.5(C2) D38.14(D5) D39.14(DI7) D46.14(D5)
MOT: D69.4(2) R80.1 XP2-1.16 XP2-2.B8(8)
MREQ-: D10.9(2) D20.19(-MREQ) D66.10(I2) D66.13(I3) XP3-1.A16(16) XP3-2.B16(16)
NMI-: D20.17(-NMI) R13.1 XP3-1.A14(14) XP3-2.B14(14)
Q1: D62.12(D0) D63.3(D1) R93.2
Q2: D62.11(D1) D63.4(D2) R94.2
Q3: D62.10(D2) D63.6(D3) R95.2
Q4: D62.9(D3) D63.11(D4) R96.2
Q5: D63.13(D5) D67.8(-Q)
R: D42.7(2) R15.2
RAS: C2.1 D9.11(C) D15.1(SE) D16.1(SE) D17.1(SE) D18.1(SE) D52.2(SE1) R3.2 XP3-1.B8(8) XP3-2.A8(8)
RAS-: D2.9(Q) D20.6(CLK) D21.4(RAS) D22.4(RAS) D23.4(RAS) D24.4(RAS) D25.4(RAS) D26.4(RAS) D27.4(RAS) D28.4(RAS) R62.2
RB: D66.5(I3) R92.1 XP3-1.A4(4) XP3-2.B4(4)
rbb: R19.1 VD35.1(A) VT3.3(B)
rbg: R14.1 VD37.1(A) VT4.3(B)
rbr: R15.1 VD36.1(A) VT5.3(B)
RD-: D10.8(1) D12.12(1) D14.2 D14.12(1) D20.21(-RD) D70.4(-RD) XP3-1.A18(18) XP3-2.B18(18)
RDROM0-: D29.22(/OE) D30.1(A15) D57.11(3)
RDT: D68.9(1) D68.10(2) R83.1 XP2-1.30 XP2-2.B15(15)
RES-: C1.1 D20.26(-RES) D48.1(R) D49.1(R) D51.16(-RES) D59.1(R) D65.1(R) R7.1 VD5.1(A) XP1-1.B23(23) XP1-2.B22(22) XP3-1.B20(20) XP3-2.A20(20)
RFSH-: D12.13(2) D20.28(-RFSH) XP3-1.A25(25) XP3-2.B25(25)
Ro: R33.1 XP1-1.B29(29) XP1-2.B28(28) XP3.4(R)
RTH: R47.1 R48.1 R50.2 XP1-1.A26(26) XP1-2.A25(25)
RWD: D63.12(Q5) D63.14(D6) D70.27(RWD)
S: D67.2(D) D67.6(&#126;Q) D70.26(S)
SCR-: D14.8(3) D39.15(SEM0)
SID: D45.10(2) XP2-1.32 XP2-2.B16(16)
SOUND: D35.2(Q1) R60.2
STB: D69.2 R91.2 XP1-1.A16(16) XP1-2.A15(15)
STP: D69.12(2) XP2-1.20 XP2-2.B10(10)
STROBE: D49.12(Q5) D69.1
SYNC: R12.1 VT2.2(C) XP1-1.A28(28) XP1-2.A27(27) XP3.8(SN)
T_IN: C13.2 XP1-1.A25(25) XP1-2.A24(24)
T_OUT: C11.1 XP1-1.B25(25) XP1-2.B24(24)
TAPE: D35.7(Q3) R43.2
TI: D2.5(Q) D2.11(С) D40.9(C)
TI-: D2.2(D) D2.6(&#126;Q) D3.5(C1) D39.7(SYN)
TIN: D36.14(4.0) D43.8(O) D43.10(O)
TR0: D70.34(-TR0) R81.1 XP2-1.26 XP2-2.B13(13)
TX: D49.15(Q6) R88.1
TxD: R23.1 R24.2 XP1-1.B28(28) XP1-2.B27(27)
VIDEO: R39.1 XP1-1.A30(30) XP1-2.A29(29) XP3.10(V)
WAIT: D9.6(&#126;Q) D59.3(С) D59.11(C)
WAIT-: D20.24(-WAIT) R8.1 XP3-1.A21(21) XP3-2.B21(21)
WE-: D9.8(-Q) D21.3(WE) D22.3(WE) D23.3(WE) D24.3(WE) D25.3(WE) D26.3(WE) D27.3(WE) D28.3(WE)
WPG: D69.8(2) XP2-1.24 XP2-2.B12(12)
WR7FFD-: D52.15(E2) D53.13(Y2)
WR-: D10.3(2) D10.12(2) D20.22(-WR) D53.1(A1) D54.3(A3) D70.2(-WR) XP3-1.A19(19) XP3-2.B19(19)
WRBUF-: D12.6(3) D13.9(1) D38.11(C) R59.2
WRDOSFF-: D54.12(Y3) D65.9(C)
WRP: D70.36(-WRPT) R87.1 XP2-1.28 XP2-2.B14(14)
WRPRT-: D10.13(3) D60.11(C)
Y: D42.9(3) R16.2 R17.2 R18.2 XP3.7(Y)
Net-(C1X-1): C1X.1 D4.11(-V) R5.2
Net-(C3-1): C3.1 D59.4(S) R11.1
Net-(C3X-2): C3X.2 D9.4(S) R59.1
Net-(C4-2): C4.2 D11.10(2) R10.2
Net-(C6-1): C6.1 D11.13(2) R26.2
Net-(C11-2): C11.2 C12.2 R43.1 R44.1 R60.1
Net-(C12-1): C12.1 R66.2
Net-(C13-1): C13.1 R40.2
Net-(D1.2-3): D1.3(1) R1.1 ZQ1.2(OSC2)
Net-(D1.2-4): D1.4(2) D1.5(1) R1.2 R2.1
Net-(D1.5-10): D1.10(2) D31.5(I3)
Net-(D1.6-12): D1.12(2) D41.1(R)
Net-(D2.2-8): D2.8(&#126;Q) R3.1
Net-(D3-12): D3.12(-P) D4.5(C1)
Net-(D4-12): D4.12(-P) D8.3(С) D14.5(2)
Net-(D5-12): D5.12(-P) D6.5(C1)
Net-(D7.1-6): D7.6(Q3) D7.10(CE)
Net-(D8.1-2): D8.2(D) D8.6(&#126;Q) D14.4(1) D31.3(I1)
Net-(D8.2-8): D8.8(-Q) D8.12(D) D13.2
Net-(D9.1-3): D9.3(С) D58.6(2)
Net-(D9.1-5): D9.5(Q) R8.2
Net-(D9.2-12): D9.12(D) D66.8(O)
Net-(D10.1-2): D10.2(1) D32.12(1) D55.9(Y6)
Net-(D10.2-4): D10.4(3) D61.3(D2)
Net-(D10.2-5): D10.5(1) D61.2(D1) D70.18(SR)
Net-(D10.2-6): D10.6(2) D61.4(D3) D70.17(SL)
Net-(D10.3-10): D10.10(3) D12.2 R26.1
Net-(D10.4-11): D10.11(1) D55.14(Y1)
Net-(D11.1-2): D11.2 R6.2 VD3.1(A) VD4.1(A)
Net-(D11.1-3): D11.3 D42.1(SE)
Net-(D11.2-6): D11.6(3) D56.2(C)
Net-(D11.3-8): D11.8(3) R9.1
Net-(D12.4-11): D12.11(3) D66.11(I3)
Net-(D13.1-3): D13.3 D31.11(I3)
Net-(D13.3-10): D13.10(2) D14.10(2) D31.12(O)
Net-(D14.1-1): D14.1 D32.11(3)
Net-(D14.1-3): D14.3 D32.2
Net-(D14.2-6): D14.6(3) R5.1
Net-(D14.4-13): D14.13(2) D57.8(3)
Net-(D19-4): D19.4(1) D52.5(1.1)
Net-(D30-22): D30.22(/OE) D58.2
Net-(D32.2-4): D32.4(1) D57.13(2) D58.12(2)
Net-(D32.3-10): D32.10(2) D59.5(Q)
Net-(D32.4-13): D32.13(2) D55.12(Y3)
Net-(D33-12): D33.12(4) D42.10(3.1) D42.11(3.0)
Net-(D33-13): D33.13(3) VD3.2(K)
Net-(D33-14): D33.14(2) D42.13(4.1)
Net-(D33-15): D33.15(1) D42.6(2.1)
Net-(D34-12): D34.12(4) D42.5(2.0)
Net-(D34-13): D34.13(3) D42.2(1.0)
Net-(D34-14): D34.14(2) D42.14(4.0)
Net-(D34-15): D34.15(1) D42.3(1.1)
Net-(D39-13): D39.13(DO) D40.1(D0)
Net-(D41.1-3): D41.3(С) D41.8(-Q) D42.15(E)
Net-(D41.1-5): D41.5(Q) R25.2
Net-(D43.1-1): D43.1(I) R40.1 R41.2
Net-(D43.1-2): D43.2(O) R41.1 R42.2
Net-(D43.2-3): D43.3(I) R42.1
Net-(D43.2-4): D43.4(O) D43.5(I)
Net-(D43.3-6): D43.6(O) D43.9(I) D43.11(I)
Net-(D45.1-1): D45.1 TP7.1(TP1)
Net-(D45.1-2): D45.2 TP8.1(TP1)
Net-(D45.5-11): D45.11(1) D65.12(Q5)
Net-(D47-1): D47.1(SE) D50.11(3)
Net-(D47-2): D47.2(1.0) D48.2(Q1)
Net-(D47-5): D47.5(2.0) D48.5(Q2)
Net-(D47-11): D47.11(3.0) D48.7(Q3)
Net-(D49-2): D49.2(Q1) R92.2
Net-(D49-5): D49.5(Q2) D58.13(1)
Net-(D50.1-1): D50.1 D53.11(Y4)
Net-(D50.1-2): D50.2 D50.4(1) D53.9(Y6)
Net-(D50.2-5): D50.5(2) D53.7(Y7)
Net-(D50.3-8): D50.8(3) D53.5(E2)
Net-(D51-4): D51.4(ACB) R46.2 R47.2
Net-(D51-5): D51.5(ACA) R45.2
Net-(D53-4): D53.4(E1) D55.10(Y5)
Net-(D54-10): D54.10(Y5) VD1.2(K)
Net-(D54-14): D54.14(Y1) VD2.2(K)
Net-(D55-7): D55.7(Y7) D58.9(1)
Net-(D57.1-1): D57.1 TP1.1(TP1)
Net-(D57.1-2): D57.2 TP2.1(TP1)
Net-(D57.1-3): D57.3 TP3.1(TP1)
Net-(D57.2-4): D57.4(1) TP4.1(TP1)
Net-(D57.2-5): D57.5(2) TP5.1(TP1)
Net-(D57.2-6): D57.6(3) TP6.1(TP1)
Net-(D57.3-9): D57.9(1) D58.8(2)
Net-(D58.2-3): D58.3(1) TP9.1(TP1)
Net-(D58.2-4): D58.4(2) TP10.1(TP1)
Net-(D58.5-10): D58.10(2) TP12.1(TP1)
Net-(D58.5-11): D58.11(1) TP11.1(TP1)
Net-(D59.1-2): D59.2(D) D59.8(-Q)
Net-(D59.2-9): D59.9(Q) R13.2
Net-(D61-6): D61.6(EL) D70.31(WD)
Net-(D61-10): D61.10(4) D69.5(1)
Net-(D62-4): D62.4(A3) D63.10(Q4) D67.3(С)
Net-(D62-5): D62.5(A0) D63.2(Q1)
Net-(D62-6): D62.6(A1) D63.5(Q2)
Net-(D62-7): D62.7(A2) D63.7(Q3)
Net-(D62-16): D62.16(VCC) VT11.2(C)
Net-(D63-15): D63.15(Q6) D67.13(R)
Net-(D64-5): D64.5 D66.12(O)
Net-(D64-8): D64.8 R11.2
Net-(D65-5): D65.5(Q2) D68.4(1) D68.5(2) D68.12(1)
Net-(D67.2-11): D67.11(C) D68.8(3) R84.1
Net-(D68.1-1): D68.1 D68.6(3) R85.1
Net-(D69.4-9): D69.9(1) D70.30(WG)
Net-(D69.5-11): D69.11(1) D70.16(DIR)
Net-(D69.6-13): D69.13(1) D70.15(STP)
Net-(D70-40): D70.40(12V) VT10.2(C)
Net-(R16-1): R16.1 VD36.2(K)
Net-(R17-1): R17.1 VD35.2(K)
Net-(R18-1): R18.1 VD37.2(K)
Net-(R21-1): R21.1 VT7.2(C)
Net-(R21-2): R21.2 R22.1 VT8.3(B)
Net-(R23-2): R23.2 VT8.2(C)
Net-(R25-1): R25.1 VT1.3(B) VT2.3(B)
Net-(R27-2): R27.2 R28.1 R29.2 R30.2 R31.2 VT1.2(C) VT6.3(B)
Net-(R29-1): R29.1 R34.2 R35.2 VT4.1(E)
Net-(R30-1): R30.1 R36.2 R37.2 VT3.1(E)
Net-(R31-1): R31.1 R32.2 R33.2 VT5.1(E)
Net-(R38-2): R38.2 R39.2 VT6.1(E)
Net-(R56-1): R56.1 VT9.3(B)
Net-(R57-1): R57.1 VT9.2(C)
Net-(R57-2): R57.2 R58.2 VT10.3(B)
Net-(R80-2): R80.2 VT11.3(B)
Net-(R88-2): R88.2 VT7.3(B)
Net-(VD14-2): VD14.2(K) VT9.1(E)

Not connected (* = marked no-connect by the designer): D1 7(GND) 14(VCC); D2 7(GND) 14(VCC); D3 8(GND) 13(-B)* 16(VCC); D4 8(GND) 13(-B)* 16(VCC); D5 8(GND) 13(-B)* 16(VCC); D6 8(GND) 12(-P)* 13(-B)* 16(VCC); D7 3(Q0)* 4(Q1)* 5(Q2)* 8(GND) 12(Q1)* 13(Q2)* 14(Q3)* 16(VCC); D8 7(GND) 14(VCC); D9 7(GND) 9(Q)* 14(VCC); D10 7(GND) 14(VCC); D11 7(GND) 14(VCC); D12 7(GND) 14(VCC); D13 7(GND) 14(VCC); D14 7(GND) 14(VCC); D15 8(GND) 16(VCC); D16 8(GND) 16(VCC); D17 8(GND) 16(VCC); D18 8(GND) 16(VCC); D19 8(GND) 16(VCC); D20 11(VCC) 29(GND); D21 8(VCC) 16(GND); D22 8(VCC) 16(GND); D23 8(VCC) 16(GND); D24 8(VCC) 16(GND); D25 8(VCC) 16(GND); D26 8(VCC) 16(GND); D27 8(VCC) 16(GND); D28 8(VCC) 16(GND); D29 14(GND) 28(VCC); D30 14(GND) 28(VCC); D31 7(GND) 14(VCC); D32 7(GND) 14(VCC); D33 8(GND) 16(VCC); D34 8(GND) 16(VCC); D35 8(GND) 12(Q5)* 16(VCC); D36 8(GND) 16(VCC); D37 8(GND) 16(VCC); D38 10(GND) 20(VCC); D39 8(GND) 16(VCC); D40 7(GND) 11(3)* 12(2)* 13(1)* 14(VCC); D41 6(&#126;Q)* 7(GND) 9(Q)* 14(VCC); D42 8(GND) 16(VCC); D43 7(GND) 14(VCC); D44 7(GND) 14(VCC); D45 7(GND) 14(VCC); D46 10(GND) 20(VCC); D47 8(GND) 16(VCC); D48 8(GND) 16(VCC); D49 7(Q3)* 8(GND) 16(VCC); D50 7(GND) 14(VCC); D51 3(VCC) 6(GND) 7(IOA7)* 8(IOA6)* 9(IOA5)* 10(IOA4)* 11(IOA3)* 12(IOA2)* 13(IOA1)* 14(IOA0)*; D52 8(GND) 16(VCC); D53 8(GND) 10(Y5)* 12(Y3)* 14(Y1)* 16(VCC); D54 8(GND) 9(Y6)* 11(Y4)* 13(Y2)* 15(Y0)* 16(VCC); D55 8(GND) 11(Y4)* 13(Y2)* 15(Y0)* 16(VCC); D56 8(GND) 15(P2)* 16(VCC); D57 7(GND) 14(VCC); D58 7(GND) 14(VCC); D59 7(GND) 14(VCC); D60 10(GND) 20(VCC); D61 7(GND) 11(3)* 12(2)* 13(1)* 14(VCC); D63 8(GND) 16(VCC); D64 7(GND) 14(VCC); D65 2(Q1)* 3(D1)* 8(GND) 16(VCC); D66 7(GND) 14(VCC); D67 5(Q)* 7(GND) 9(Q)* 14(VCC); D68 7(GND) 14(VCC); D69 7(GND) 14(VCC); D70 20(GND) 21(VCC) 29(T43)* 33(-VFOE)*; XP1-1 A9(9)*; XP1-2 A8(8)*; XP2-1 2* 4* 6* 14* 34*; XP2-2 B1(1)* B2(2)* B3(3)* B7(7)* B17(17)*; XP3-1 A5(5)* A20(20)* A22(22)* A23(23)* A28(28)* A29(29)* B5(5)* B16(16)* B17(17)* B18(18)* B29(29)*; XP3-2 A5(5)* A16(16)* A17(17)* A18(18)* A29(29)* B5(5)* B20(20)* B22(22)* B23(23)* B28(28)* B29(29)*

## Notes on the sheet
- ZS-Scorpion v12.2.1 aka "Желток"
- R62 установить при
  использовании CMOS процессора
- Мультиплексор старшего
  разряда адреса ОЗУ
- Установить при использовании
  в качестве D62 - РТ4
- 7FFD
- Комутатор страниц ОЗУ
- 1FFD
- Селектор окна
  C000-FFFF
- Блок ПЗУ 0-3FFF
- Доработки:
  1) Резистор подтяжки на CLK для CMOS процессора.
  2) H5 вместо H4 для более правильной синхры.
  3) Диод на Reset для правильного сброса при передергивании питания.
  4) Защита на последовательном порту.
  5) Не нужна перемычка на питание процессора
  6) Оптимизировано положение ресисторов и конденсаторов для более удобного монтажа
  7) Шаг выводов всех элементов кратен 2.54мм
